# Altium schematic sheet Sheet1.SchDoc
size A4
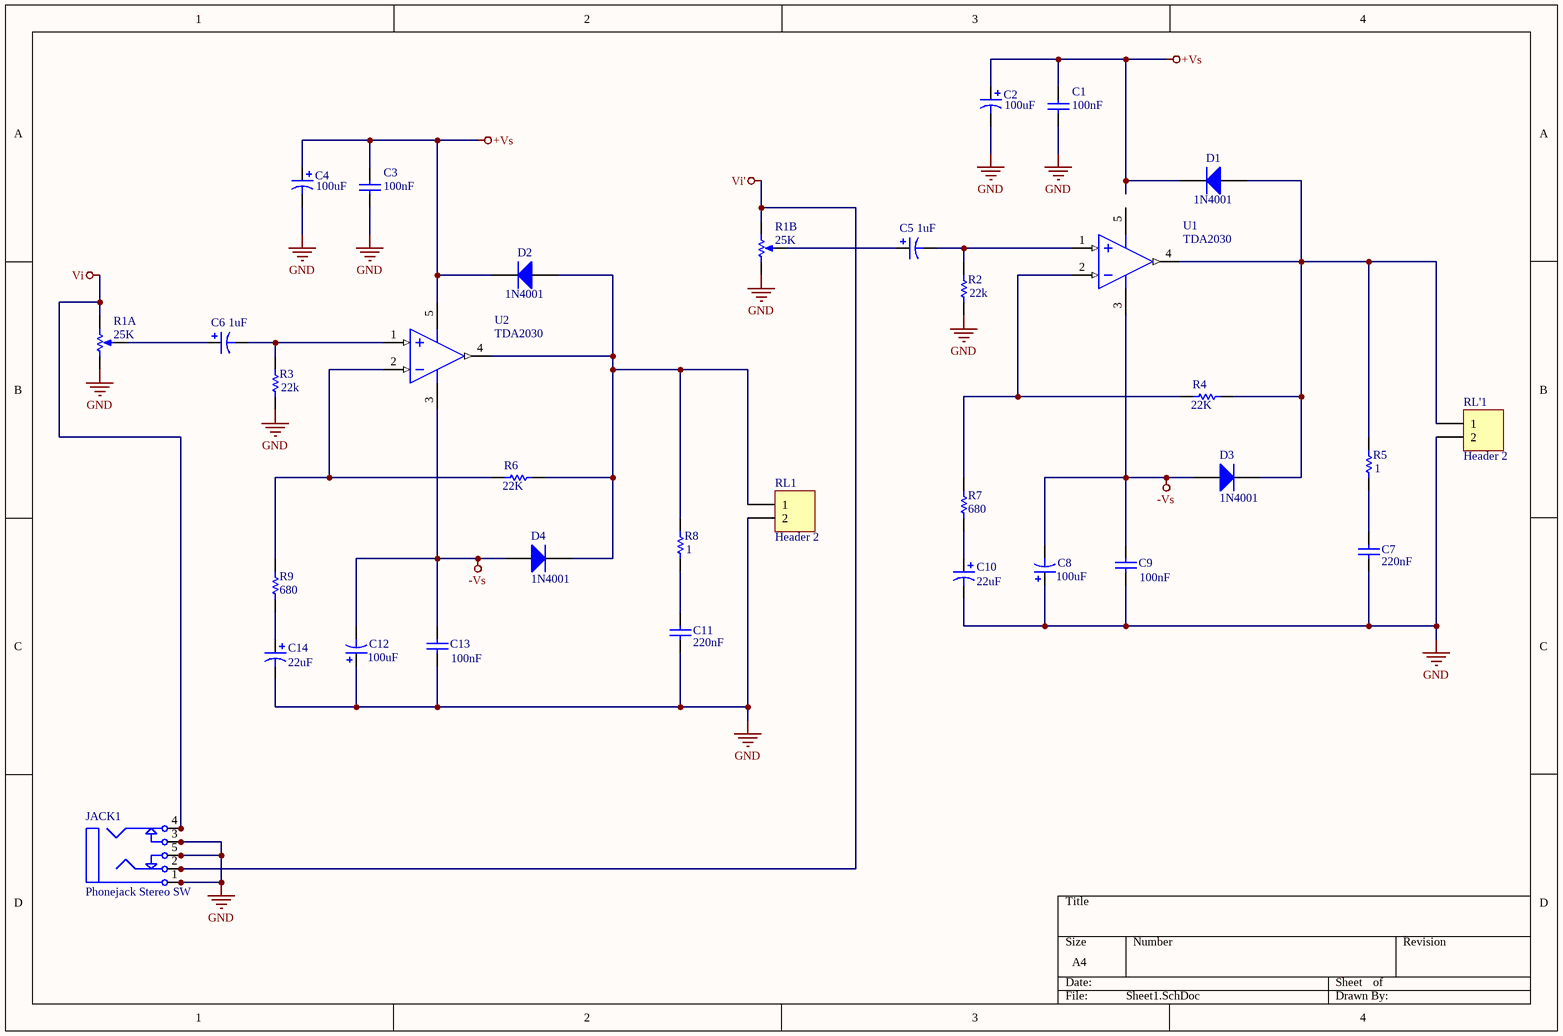
[diagram p0: Sheet1.SchDoc]

## Parts
C1  value 100nF  [RAD-0.3]  (hidden comment: Cap)
C2  value 100uF  [RB7.6-15]  (hidden comment: Cap Pol1)
C3  value 100nF  [RAD-0.3]  (hidden comment: Cap)
C4  value 100uF  [RB7.6-15]  (hidden comment: Cap Pol1)
C5  value 1uF  [RB7.6-15]  (hidden comment: Cap Pol1)
C6  value 1uF  [RB7.6-15]  (hidden comment: Cap Pol1)
C7  value 220nF  [RAD-0.3]  (hidden comment: Cap)
C8  value 100uF  [RB7.6-15]  (hidden comment: Cap Pol1)
C9  value 100nF  [RAD-0.3]  (hidden comment: Cap)
C10  value 22uF  [RB7.6-15]  (hidden comment: Cap Pol1)
C11  value 220nF  [RAD-0.3]  (hidden comment: Cap)
C12  value 100uF  [RB7.6-15]  (hidden comment: Cap Pol1)
C13  value 100nF  [RAD-0.3]  (hidden comment: Cap)
C14  value 22uF  [RB7.6-15]  (hidden comment: Cap Pol1)
D1  1N4001  [DO-41]
D2  1N4001  [DO-41]
D3  1N4001  [DO-41]
D4  1N4001  [DO-41]
JACK1  Phonejack Stereo SW  [JACK FACHERO]
R1  value 25K  [VR5]  (hidden comment: RPot)  (parts A,B of 2)
R2  value 22k  [AXIAL-0.3]  (hidden comment: Res1)
R3  value 22k  [AXIAL-0.3]  (hidden comment: Res1)
R4  value 22K  [AXIAL-0.3]  (hidden comment: Res1)
R5  value 1  [AXIAL-0.3]  (hidden comment: Res1)
R6  value 22K  [AXIAL-0.3]  (hidden comment: Res1)
R7  value 680  [AXIAL-0.3]  (hidden comment: Res1)
R8  value 1  [AXIAL-0.3]  (hidden comment: Res1)
R9  value 680  [AXIAL-0.3]  (hidden comment: Res1)
RL1  Header 2  [HDR1X2]
RL'1  Header 2  [HDR1X2]
U1  TDA2030  [PentawattV]
U2  TDA2030  [PentawattV]

## Nets
+Vs: C1.2 C2.1 C3.2 C4.1 D1.2(K) D2.2(K) U2.5(V+)
-Vs: C8.2 C9.2 C12.2 C13.2 D3.1(A) D4.1(A) U1.3(V-) U2.3(V-)
GND: C1.1 C2.2 C3.1 C4.2 C7.1 C8.1 C9.1 C10.2 C11.1 C12.1 C13.1 C14.2 JACK1.1 JACK1.1A JACK1.1B JACK1.3 JACK1.3A JACK1.3B JACK1.5 JACK1.5A JACK1.5B R1.1(TOP) R2.1 R3.1 RL1.2 RL'1.2
Vi: JACK1.4 JACK1.4A JACK1.4B R1.2(BOT)
Vi': JACK1.2 JACK1.2A JACK1.2B R1.2(BOT)
NetC5_1: C5.1 R1.3(TAP)
NetC5_2: C5.2 R2.2 U1.1(IN+)
NetC6_1: C6.1 R1.3(TAP)
NetC6_2: C6.2 R3.2 U2.1(IN+)
NetC7_2: C7.2 R5.1
NetC10_1: C10.1 R7.1
NetC11_2: C11.2 R8.1
NetC14_1: C14.1 R9.1
NetD1_1: D1.1(A) D3.2(K) R4.1 R5.2 RL'1.1 U1.4(OUT)
NetD2_1: D2.1(A) D4.2(K) R6.1 R8.2 RL1.1 U2.4(OUT)
NetR4_2: R4.2 R7.2 U1.2(IN-)
NetR6_2: R6.2 R9.2 U2.2(IN-)

Not connected (* = marked no-connect by the designer): U1 5(V+)

## Library data of the parts
C1 C3 C7 C9 C11 C13 = Cap: Capacitor; Published: 8-Jun-2000; LatestRevisionDate: 17-Jul-2002; LatestRevisionNote: Re-released for DXP Platform.; PackageReference: RAD-0.3; Publisher: Altium Limited; PackageDescription: Radial Cap, Thru-Hole; 2 Leads; 0.3 in Pin Spacing
C2 C4-C6 C8 C10 C12 C14 = Cap Pol1: Polarized Capacitor (Radial); Published: 8-Jun-2000; LatestRevisionDate: 17-Jul-2002; LatestRevisionNote: Re-released for DXP Platform.; PackageReference: RB7.6-15; Publisher: Altium Limited; PackageDescription: Polarized Capacitor (Radial); 2 Leads
D1-D4 = Diode 1N4001: 1 Amp General Purpose Rectifier; Published: 8-Jun-2000; LatestRevisionDate: 17-Jul-2002; LatestRevisionNote: Re-released for DXP Platform.; DatasheetVersion: 1998; PackageVersion: Aug-1999; PackageReference: DO-41; Publisher: Altium Limited; PackageDescription: Diode, Axial; Body 5.2 x 2.7 mm (LxDia. max), Lead Dia. 0.86 mm (max); Code_JEDEC: DO-204-AL; ComponentLink1Description: Manufacturer Link; ComponentLink1URL: http://www.fairchildsemi.com/; ComponentLink2Description: Datasheet; ComponentLink2URL: http://www.fairchildsemi.com/ds/1N%2F1N4001.pdf
JACK1 = Phonejack Stereo SW: 3-Conductor Jack with 2 break contacts (normals) and 2 auxiliary make contacts; Published: 5-Jan-2004; LatestRevisionDate: 17-Dec-2003; LatestRevisionNote: PCB Footprint replaced.; DatasheetDocument: 07-Mar-2000; Publisher: Altium Limited; ComponentLink1Description: Manufacturer Link; ComponentLink1URL: http://domino.kycon.com/internet/Products.html
R1 = RPot: Potentiometer; Sim Note: Enter the Resistance value and the set point into parameter fields.; Set Position: 0.5; Published: 8-Jun-2000; LatestRevisionDate: 17-Jul-2002; LatestRevisionNote: Re-released for DXP Platform.; PackageReference: VR5; Publisher: Altium Limited; PackageDescription: Variable Resistor, Thru-Hole; 3 Leads
R2-R9 = Res1: Resistor; Published: 8-Jun-2000; LatestRevisionDate: 17-Jul-2002; LatestRevisionNote: Re-released for DXP Platform.; PackageReference: AXIAL-0.3; Publisher: Altium Limited; PackageDescription: Axial Device, Thru-Hole; 2 Leads; 0.3 in Pin Spacing
RL1 RL'1 = Header 2: Header, 2-Pin; LatestRevisionDate: 17-Jul-2002; LatestRevisionNote: Re-released for DXP Platform.; Publisher: Altium Limited
U1 U2 = TDA2030: Dual Operational Amplifier; Published: 16-Jan-2001; LatestRevisionDate: 04-Mar-2005; LatestRevisionNote: Stylized 3D Model Added.; DatasheetVersion: Aug-1994; PackageVersion: Jun-1999; PackageReference: P008; Publisher: Altium Limited; PackageDescription: DIP; 8 Leads; Row Spacing 7.62 mm; Pitch 2.54 mm; Code_JEDEC: MO-001-AN; ComponentLink1Description: Manufacturer Link; ComponentLink1URL: http://www.ti.com/; ComponentLink2Description: Datasheet; ComponentLink2URL: http://www-s.ti.com/sc/ds/lf353.pdf